# EAGLE design FSR_amp_v0.1 (EAGLE 7.2.0)
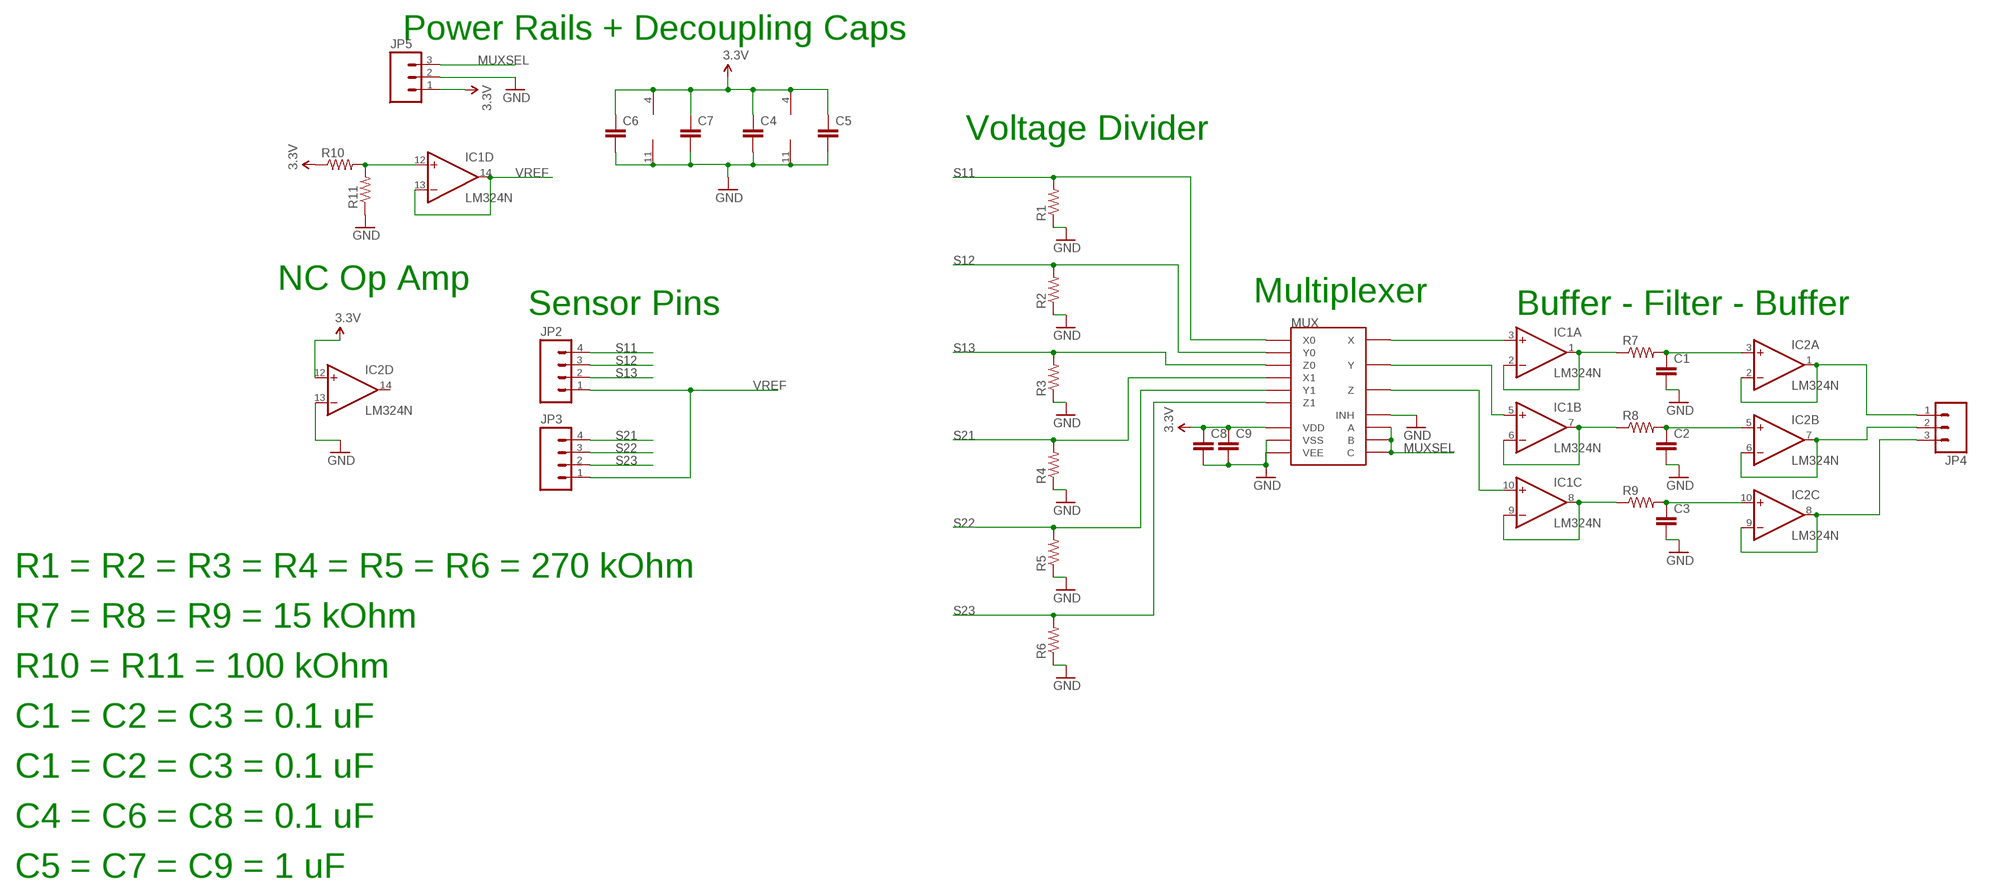
[diagram p0: schematic, sheet 1]

## Parts
C1  CAPPTH  [CAP-PTH-SMALL]
C2  CAPPTH  [CAP-PTH-SMALL]
C3  CAPPTH  [CAP-PTH-SMALL]
C4  CAPPTH  [CAP-PTH-SMALL]
C5  CAPPTH  [CAP-PTH-SMALL]
C6  CAPPTH  [CAP-PTH-SMALL]
C7  CAPPTH  [CAP-PTH-SMALL]
C8  CAPPTH  [CAP-PTH-SMALL]
C9  CAPPTH  [CAP-PTH-SMALL]
IC1  LM324N  [DIL14]
IC2  LM324N  [DIL14]
JP2  M04POLAR  [MOLEX-1X4]
JP3  M04POLAR  [MOLEX-1X4]
JP4  M03POLAR  [MOLEX-1X3]
JP5  M03POLAR  [MOLEX-1X3]
MUX  MC14053BCPDIL16  [DIL16]
R1  R-US_0207/10  [0207/10]
R2  R-US_0207/10  [0207/10]
R3  R-US_0207/10  [0207/10]
R4  R-US_0207/10  [0207/10]
R5  R-US_0207/10  [0207/10]
R6  R-US_0207/10  [0207/10]
R7  R-US_0207/10  [0207/10]
R8  R-US_0207/10  [0207/10]
R9  R-US_0207/10  [0207/10]
R10  R-US_0207/10  [0207/10]
R11  R-US_0207/10  [0207/10]

## Nets
3.3V: C4.1 C5.1 C6.1 C7.1 C8.1 C9.1 IC1.4(P:V+) IC2.4(P:V+) IC2.12(D:+IN) JP5.1 MUX.16(VDD) R10.1
GND: C1.2 C2.2 C3.2 C4.2 C5.2 C6.2 C7.2 C8.2 C9.2 IC1.11(P:V-) IC2.11(P:V-) IC2.13(D:-IN) JP5.2 MUX.6(INH) MUX.7(VEE) MUX.8(VSS) R1.1 R2.1 R3.1 R4.1 R5.1 R6.1 R11.1
MUXSEL: JP5.3 MUX.9(C) MUX.10(B) MUX.11(A)
N$1: IC1.1(A:OUT) IC1.2(A:-IN) R7.1
N$2: IC1.3(A:+IN) MUX.14(X)
N$3: IC1.6(B:-IN) IC1.7(B:OUT) R8.1
N$4: IC1.5(B:+IN) MUX.15(Y)
N$5: IC1.8(C:OUT) IC1.9(C:-IN) R9.1
N$6: IC1.10(C:+IN) MUX.4(Z)
N$7: IC1.12(D:+IN) R10.2 R11.2
N$12: C1.1 IC2.3(A:+IN) R7.2
N$13: C2.1 IC2.5(B:+IN) R8.2
N$14: C3.1 IC2.10(C:+IN) R9.2
N$15: IC2.8(C:OUT) IC2.9(C:-IN) JP4.3
N$16: IC2.6(B:-IN) IC2.7(B:OUT) JP4.2
N$17: IC2.1(A:OUT) IC2.2(A:-IN) JP4.1
S11: JP2.4 MUX.12(X0) R1.2
S12: JP2.3 MUX.2(Y0) R2.2
S13: JP2.2 MUX.5(Z0) R3.2
S21: JP3.4 MUX.13(X1) R4.2
S22: JP3.3 MUX.1(Y1) R5.2
S23: JP3.2 MUX.3(Z1) R6.2
VREF: IC1.13(D:-IN) IC1.14(D:OUT) JP2.1 JP3.1
Unconnected: IC2.14(D:OUT)

## Notes on the sheet
- Power Rails + Decoupling Caps
- Voltage Divider
- NC Op Amp
- Multiplexer
- Sensor Pins | Buffer - Filter - Buffer
- R1 = R2 = R3 = R4 = R5 = R6 = 270 kOhm
- R7 = R8 = R9 = 15 kOhm
- R10 = R11 = 100 kOhm
- C1 = C2 = C3 = 0.1 uF
- C1 = C2 = C3 = 0.1 uF
- C4 = C6 = C8 = 0.1 uF
- C5 = C7 = C9 = 1 uF

## Library data of the parts
C1-C9 = SparkFun:CAP: Capacitor Standard 0603 ceramic capacitor, and 0.1" leaded capacitor.
IC1 IC2 = linear:LM324: OP AMP
JP2 JP3 = SparkFun:M04: Header 4 Standard 4-pin 0.1" header. Use with straight break away headers (SKU : PRT-00116), right angle break away headers (PRT-00553), swiss pins (PRT-00743), machine pins (PRT-00117), and female headers (PRT-00115). Molex polarized connector foot print use with SKU : PRT-08231 with associated crimp pins and housings. 1MM SMD Version SKU: PRT-10208
JP4 JP5 = SparkFun:M03: Header 3 Standard 3-pin 0.1" header. Use with straight break away headers (SKU : PRT-00116), right angle break away headers (PRT-00553), swiss pins (PRT-00743), machine pins (PRT-00117), and female headers (PRT-00115). Molex polarized connector foot print use with SKU : PRT-08232 with associated crimp pins and housings.
MUX = jreal-lib:MC14053BCP
R1-R11 = adafruit:R-US_: RESISTOR, American symbol

## Board
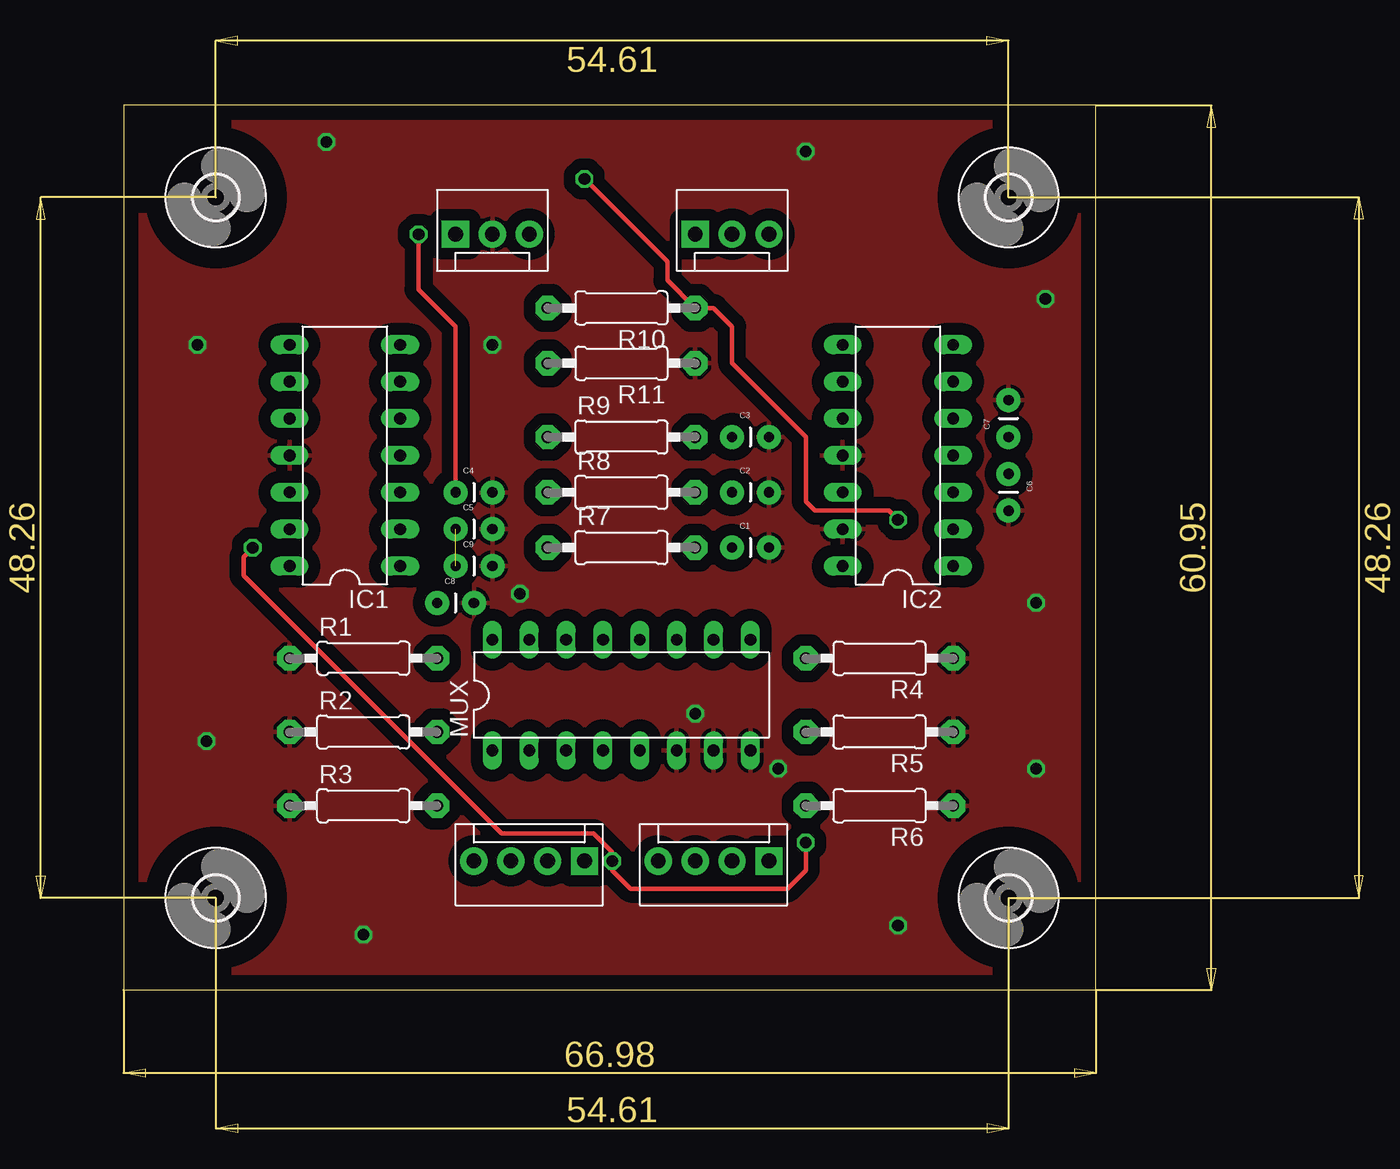
[diagram p1: board, top side]
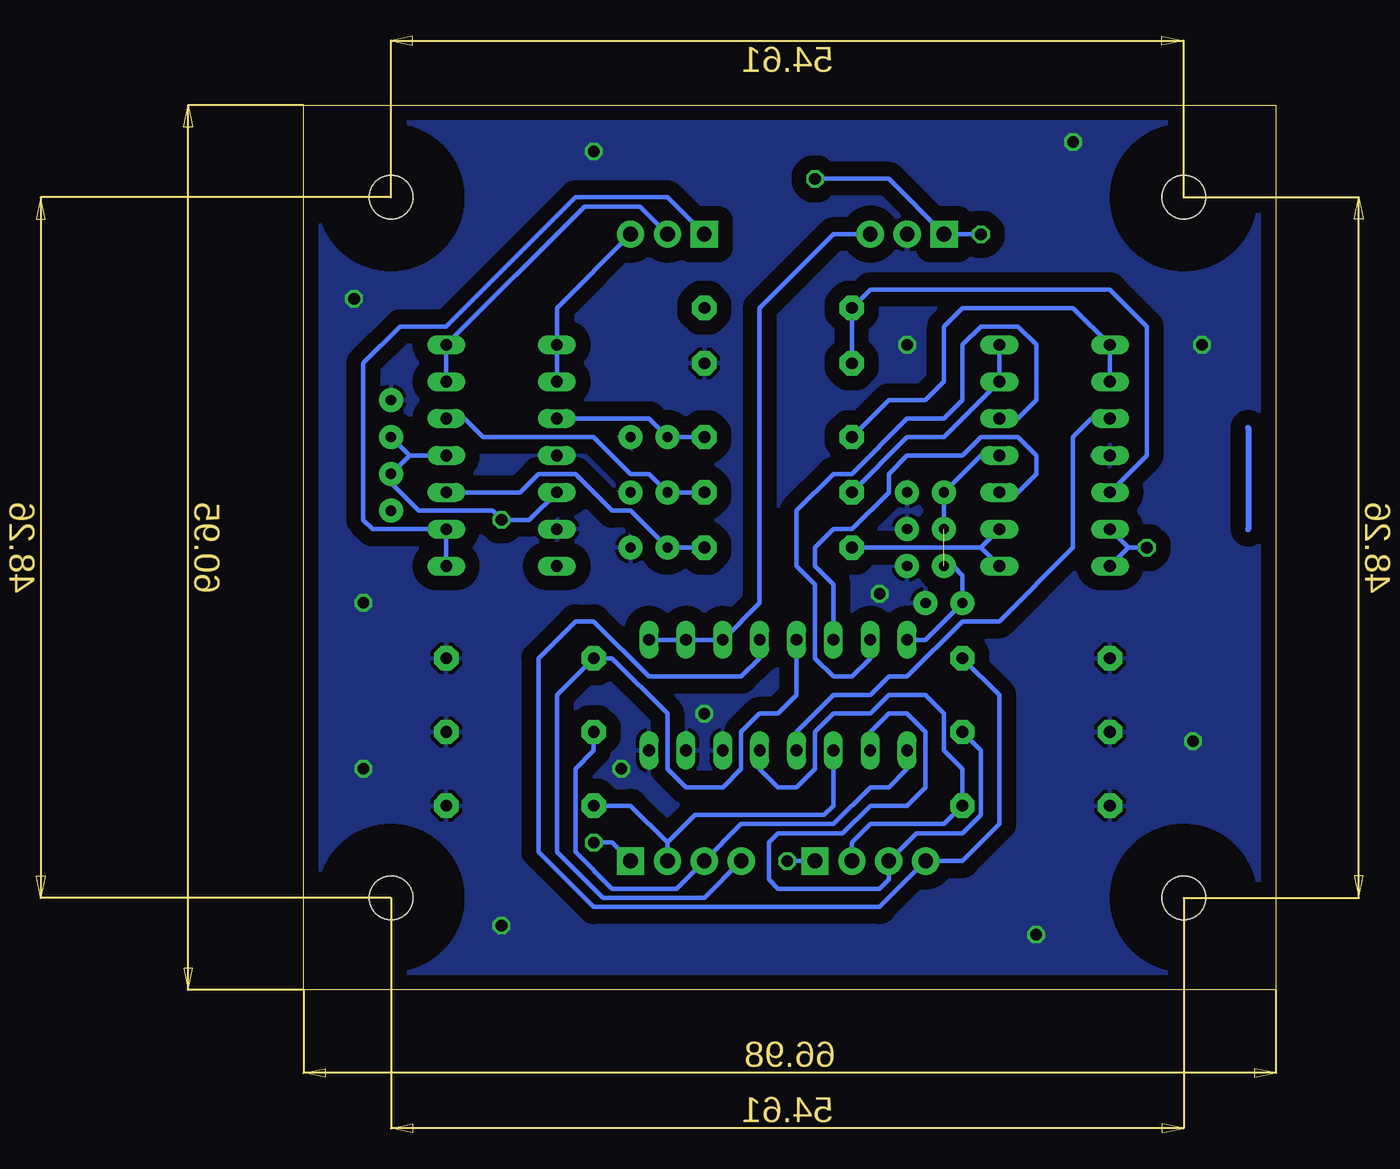
[diagram p2: board, bottom side, seen from below]

Size 66.98 x 60.95 mm. Coordinates in mm from the lower left corner, seen from the top.
Outline: 0,0 66.98,0 66.98,60.95 0,60.95 0,0
Copper layers (1*16): Top 0.035mm / dielectric 1.5mm / Bottom 0.035mm
Design rules "default": minimum track width 10mil, minimum drill 24mil, track to track 8mil, track to pad 8mil, pad to pad 8mil, via to via 8mil, smd to smd 8mil, copper to edge 40mil, drill to drill 8mil, minimum pad ring 10mil, minimum via ring 8mil, stop-mask expansion 4mil, vias tented up to drill 0mil, thermal gap 10mil

### Footprints (pad centres in the part's own frame; a part is rotated, then mirrored left to right if it is on the bottom)
CAP-PTH-SMALL = drill 0.7 pad 1.651: 1 0,0; 2 2.54,0
DIL14 = drill 0.813 long: 1 -7.62,-3.81; 2 -5.08,-3.81; 3 -2.54,-3.81; 4 0,-3.81; 5 2.54,-3.81; 6 5.08,-3.81; 7 7.62,-3.81; 8 7.62,3.81; 9 5.08,3.81; 10 2.54,3.81; 11 0,3.81; 12 -2.54,3.81; 13 -5.08,3.81; 14 -7.62,3.81
MOLEX-1X4 = drill 1.016 pad 1.88 square: 1 0,0 | drill 1.016 pad 1.88: 2 2.54,0; 3 5.08,0; 4 7.62,0
MOLEX-1X3 = drill 1.016 pad 1.88 square: 1 0,0 | drill 1.016 pad 1.88: 2 2.54,0; 3 5.08,0
DIL16 = drill 0.813 long: 1 -8.89,-3.81; 2 -6.35,-3.81; 3 -3.81,-3.81; 4 -1.27,-3.81; 5 1.27,-3.81; 6 3.81,-3.81; 7 6.35,-3.81; 8 8.89,-3.81; 9 8.89,3.81; 10 6.35,3.81; 11 3.81,3.81; 12 1.27,3.81; 13 -1.27,3.81; 14 -3.81,3.81; 15 -6.35,3.81; 16 -8.89,3.81
0207/10 = drill 0.813 pad 1.676 octagon: 1 -5.08,0; 2 5.08,0
3,0 = hole 3: 0,0

### Placement (x,y rotation side)
C1  41.91,30.48 0 top
C2  41.91,34.29 0 top
C3  41.91,38.1 0 top
C4  22.86,34.29 0 top
C5  22.86,31.75 0 top
C6  60.96,35.56 270 top
C7  60.96,38.1 90 top
C8  21.59,26.67 0 top
C9  22.86,29.21 0 top
IC1  15.24,36.83 90 top
IC2  53.34,36.83 90 top
JP2  31.75,8.89 180 top
JP3  44.45,8.89 180 top
JP4  39.37,52.07 0 top
JP5  22.86,52.07 0 top
MUX  34.29,20.32 0 top
R1  16.51,22.86 0 top
R2  16.51,17.78 0 top
R3  16.51,12.7 0 top
R4  52.07,22.86 180 top
R5  52.07,17.78 180 top
R6  52.07,12.7 180 top
R7  34.29,30.48 0 top
R8  34.29,34.29 0 top
R9  34.29,38.1 0 top
R10  34.29,46.99 180 top
R11  34.29,43.18 180 top
U$1  [3,0]  6.35,54.61 0 top
U$2  [3,0]  60.96,54.61 0 top
U$3  [3,0]  60.96,6.35 0 top
U$4  [3,0]  6.35,6.35 0 top

### Tracks (layer width: path | path; a pad name or v marks a point on that pad's centre or on a via)
3.3V  (via drill 0.8)  (1 unrouted)
  Top 0.305: v20.32,52.07 20.32,48.26 22.86,45.72 C4.1 | v31.75,55.88 37.47,50.17 37.47,48.89 R10.1 40.64,46.99 41.91,45.72 41.91,43.18 46.99,38.1 46.99,33.66 47.62,33.02 52.7,33.02 v53.34,32.39
  Bottom 0.305: IC1.4 20.32,36.83 C4.1 C5.1 | IC2.4 59.69,36.83 | C9.1 22.23,29.21 21.59,28.57 C8.1 24.13,24.13 MUX.16 | v31.75,55.88 26.67,55.88 JP5.1 v20.32,52.07 | IC2.12 51.44,32.39 v53.34,32.39 53.97,33.02 59.06,33.02 60.96,34.92 C6.1 59.69,36.83 | 59.69,36.83 C7.1
GND  (via drill 0.8)
  other vias: 39.37,19.05 45.09,15.24 13.97,58.42 5.08,44.45 5.71,17.14 16.51,3.81 53.34,4.45 62.86,15.24 62.86,26.67 63.5,47.62 46.99,57.78 25.4,44.45 27.3,27.31
  pour Top (isolate 0.813): -3.81,-3.17 71.12,-3.17 71.12,64.13 -3.81,64.13
  pour Bottom (isolate 1.016): 0,60.96 66.67,60.96 66.67,59.05 66.67,0 0,0
MUXSEL
  Bottom 0.305: MUX.9 MUX.10 MUX.11 35.56,26.67 35.56,46.99 30.48,52.07 JP5.3
N$1
  Bottom 0.305: R7.1 20.32,30.48 | IC1.1 20.32,30.48 | 20.32,30.48 IC1.2
N$2
  Bottom 0.305: MUX.14 30.48,27.94 31.75,29.21 31.75,30.48 30.48,31.75 29.21,31.75 26.67,34.29 26.67,35.56 25.4,36.83 21.59,36.83 20.32,38.1 17.78,38.1 16.51,36.83 16.51,35.56 17.78,34.29 IC1.3
N$3
  Bottom 0.305: IC1.7 IC1.6 22.86,38.1 25.4,38.1 R8.1
N$4
  Bottom 0.305: MUX.15 27.94,22.86 29.21,21.59 30.48,21.59 31.75,22.86 31.75,27.94 33.02,29.21 33.02,33.02 30.48,35.56 29.21,35.56 25.4,39.37 22.86,39.37 21.59,40.64 21.59,44.45 20.32,45.72 17.78,45.72 16.51,44.45 16.51,40.64 17.78,39.37 IC1.5
N$5
  Bottom 0.305: IC1.9 IC1.8 13.97,46.99 21.59,46.99 22.86,45.72 22.86,41.91 24.13,40.64 26.67,40.64 R9.1
N$6
  Bottom 0.305: MUX.4 33.02,17.78 30.48,20.32 27.94,20.32 26.67,21.59 25.4,21.59 21.59,25.4 19.05,25.4 13.97,30.48 13.97,38.1 12.7,39.37 IC1.10
N$7
  Bottom 0.305: R11.2 R10.2 27.94,48.26 11.43,48.26 8.89,45.72 8.89,36.83 IC1.12
N$8
  Bottom 0.406: 1.9,38.73 1.9,31.75
N$12
  Bottom 0.305: IC2.3 52.07,34.29 50.8,35.56 48.26,35.56 45.72,33.02 44.45,33.02 C1.1 R7.2
N$13
  Bottom 0.305: IC2.5 55.88,39.37 54.61,38.1 46.99,38.1 44.45,35.56 43.18,35.56 C2.1 R8.2
N$14
  Bottom 0.305: R9.2 C3.1 43.18,39.37 IC2.10
N$15
  Bottom 0.305: IC2.9 IC2.8 49.53,46.99 JP4.3
N$16
  Bottom 0.305: IC2.6 IC2.7 47.62,53.97 43.81,53.97 JP4.2
N$17
  Bottom 0.305: IC2.1 IC2.2 62.23,31.75 62.86,32.39 62.86,43.18 60.33,45.72 57.15,45.72 48.26,54.61 41.91,54.61 JP4.1
S11
  Bottom 0.305: R1.2 19.05,20.32 19.05,11.43 21.59,8.89 JP2.4 27.3,5.71 46.99,5.71 50.8,9.53 50.8,22.86 48.26,25.4 46.99,25.4 43.18,21.59 36.83,21.59 35.56,22.86 MUX.12
S12
  Bottom 0.305: R2.2 20.32,16.51 20.32,12.07 21.59,10.8 24.77,10.8 JP2.3 26.67,7.62 27.3,6.98 34.29,6.98 34.93,7.62 34.93,10.16 34.29,10.8 29.84,10.8 27.94,12.7 25.4,12.7 24.13,13.97 24.13,17.78 25.4,19.05 26.67,19.05 27.94,17.78 MUX.2
S13
  Bottom 0.305: JP2.2 29.21,10.16 27.94,11.43 22.86,11.43 R3.2 21.59,15.24 22.86,16.51 22.86,19.05 24.13,20.32 26.67,20.32 27.94,19.05 30.48,19.05 31.75,17.78 31.75,15.24 33.02,13.97 34.29,13.97 35.56,15.24 MUX.5
S21
  Bottom 0.305: MUX.13 33.02,20.32 34.29,19.05 35.56,19.05 36.83,17.78 36.83,15.24 38.1,13.97 40.64,13.97 41.91,15.24 41.91,19.05 45.72,22.86 R4.2 49.53,20.32 49.53,9.53 46.36,6.35 39.37,6.35 JP3.4
S22
  Bottom 0.305: R5.2 46.99,16.51 48.26,15.24 48.26,9.53 45.72,6.98 41.27,6.98 JP3.3 36.83,11.43 30.48,11.43 27.94,13.97 26.67,13.97 25.4,15.24 MUX.1
S23
  Bottom 0.305: MUX.3 30.48,12.7 31.12,12.07 40.01,12.07 41.91,10.16 | JP3.2 41.91,10.16 | R6.2 44.45,12.7 41.91,10.16
VREF  (via drill 0.8)
  Top 0.305: v46.99,10.16 46.99,8.25 45.72,6.98 34.93,6.98 33.66,8.25 v33.66,8.89 33.66,9.53 32.38,10.8 26.04,10.8 8.26,28.57 8.26,29.85 v8.89,30.48
  Bottom 0.305: JP3.1 45.72,10.16 v46.99,10.16 | JP2.1 v33.66,8.89 | IC1.13 10.16,30.48 | 10.16,30.48 IC1.14 | 10.16,30.48 v8.89,30.48